# EAGLE design One Dimensional Pong - Rev A.1 (EAGLE 9.2.0)
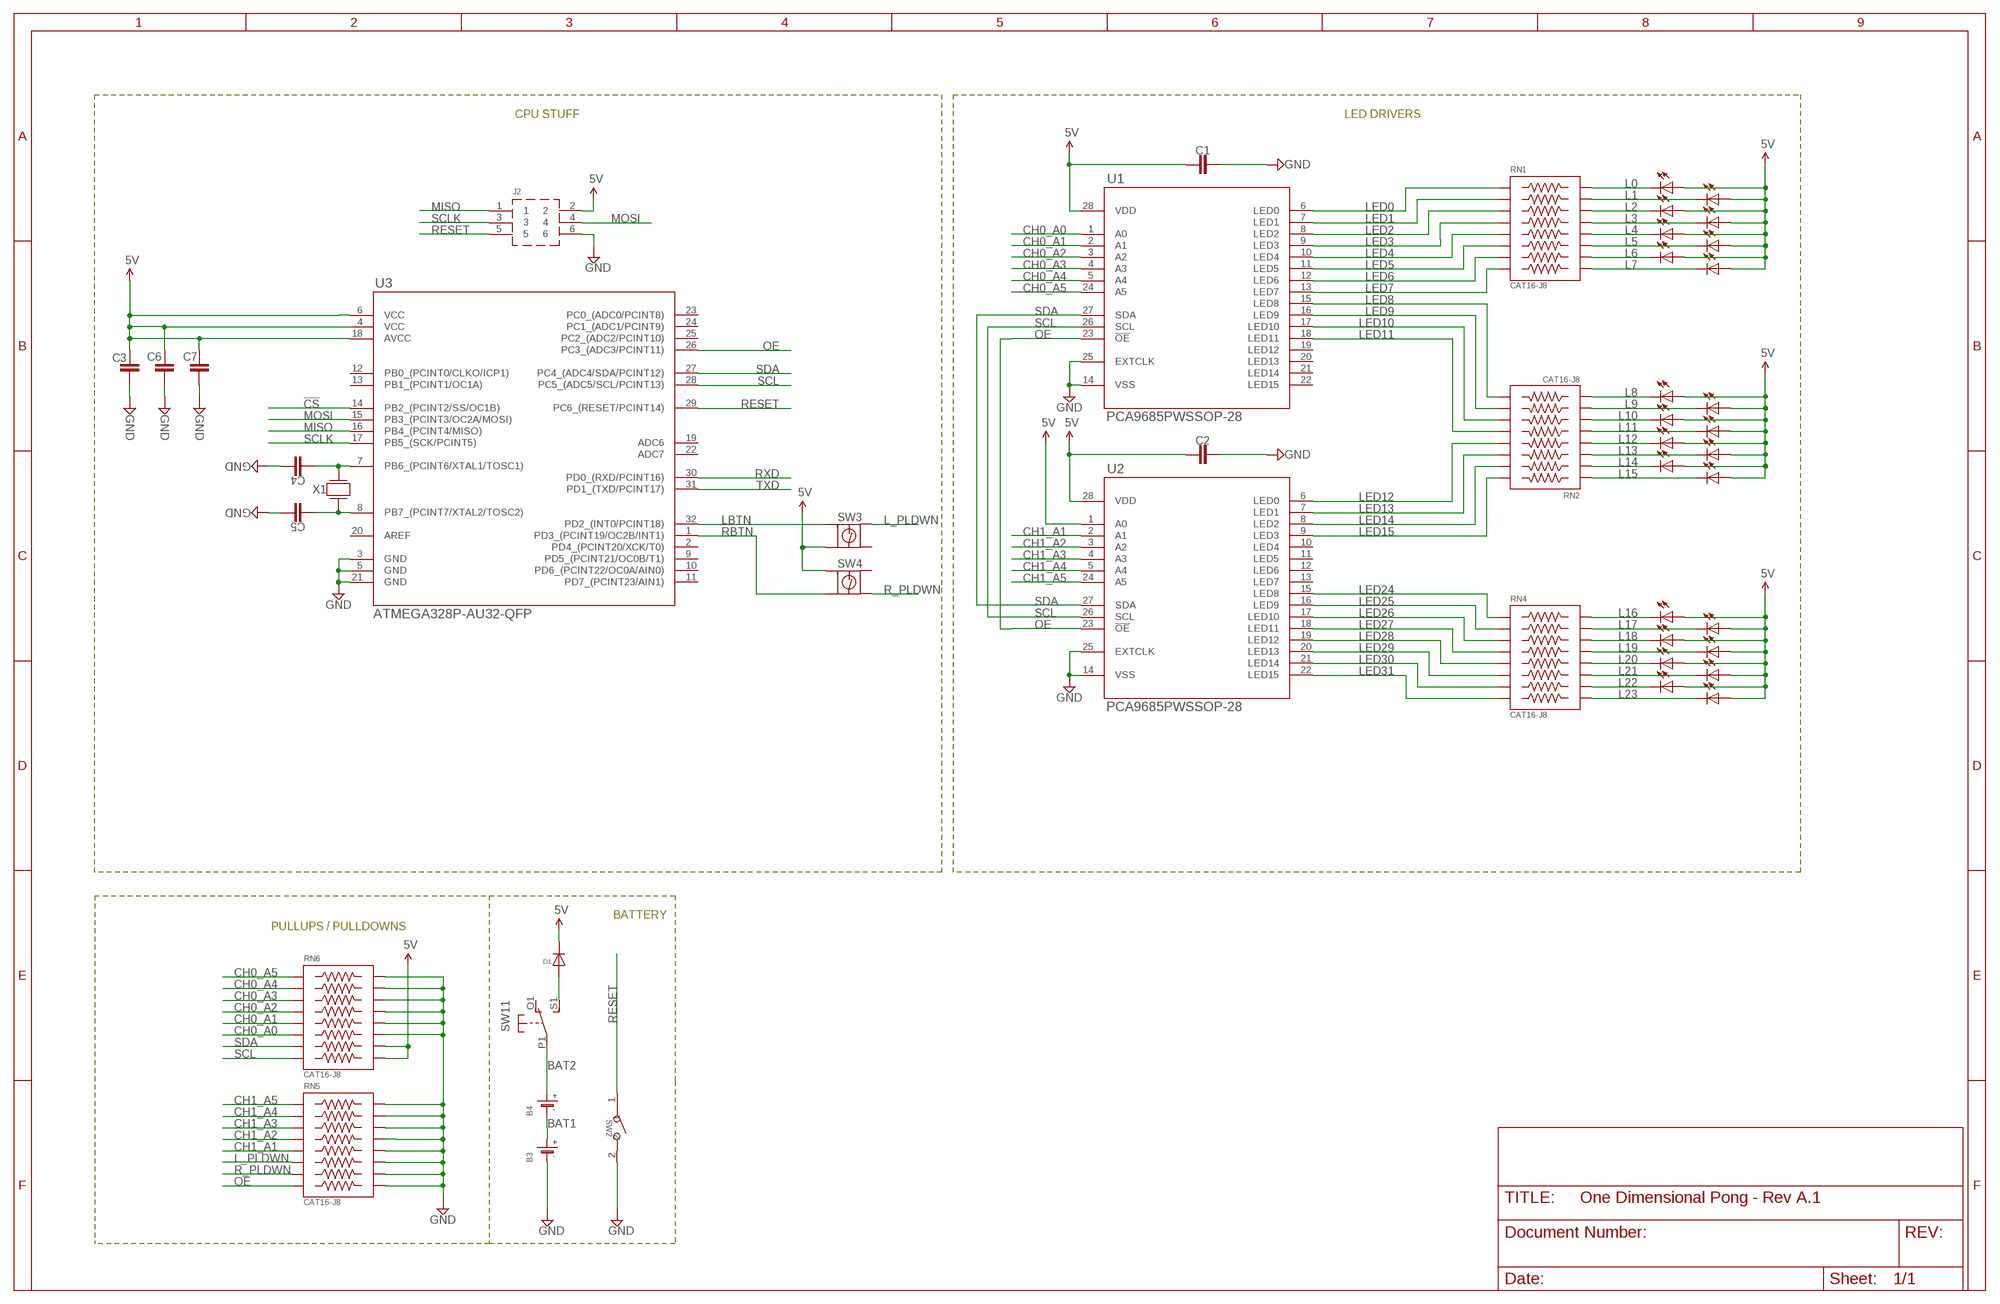
[diagram p0: schematic, sheet 1]

## Parts
B3  BATTERYCR2540-SMT  [CR2450]
B4  BATTERYCR2540-SMT  [CR2450]
C1  C-EUC0805  [C0805]
C2  C-EUC0805  [C0805]
C3  C-EUC0805  [C0805]
C4  C-EUC0805  [C0805]
C5  C-EUC0805  [C0805]
C6  C-EUC0805  [C0805]
C7  C-EUC0805  [C0805]
D1  1N4150W  [SOD-123]
J2  610106249121  [RA-SMT-HDR-2X3]
LED1  LED0805-YELLOW  [CHIP-LED0805-YELLOW]
LED2  LED0805-ORANGE  [CHIP-LED0805-ORANGE]
LED3  LEDCHIPLED_0805  [CHIPLED_0805]
LED4  LED0805-ORANGE  [CHIP-LED0805-ORANGE]
LED5  LED0805-YELLOW  [CHIP-LED0805-YELLOW]
LED6  LED0805-GREEN  [CHIP-LED0805-GREEN]
LED7  LED0805-GREEN  [CHIP-LED0805-GREEN]
LED8  LED0805-GREEN  [CHIP-LED0805-GREEN]
LED9  LED0805-GREEN  [CHIP-LED0805-GREEN]
LED10  LED0805-GREEN  [CHIP-LED0805-GREEN]
LED11  LED0805-GREEN  [CHIP-LED0805-GREEN]
LED12  LED0805-GREEN  [CHIP-LED0805-GREEN]
LED13  LED0805-GREEN  [CHIP-LED0805-GREEN]
LED14  LED0805-GREEN  [CHIP-LED0805-GREEN]
LED15  LED0805-GREEN  [CHIP-LED0805-GREEN]
LED16  LED0805-GREEN  [CHIP-LED0805-GREEN]
LED25  LED0805-GREEN  [CHIP-LED0805-GREEN]
LED26  LED0805-GREEN  [CHIP-LED0805-GREEN]
LED27  LED0805-GREEN  [CHIP-LED0805-GREEN]
LED28  LED0805-YELLOW  [CHIP-LED0805-YELLOW]
LED29  LED0805-ORANGE  [CHIP-LED0805-ORANGE]
LED30  LEDCHIPLED_0805  [CHIPLED_0805]
LED31  LED0805-ORANGE  [CHIP-LED0805-ORANGE]
LED32  LED0805-YELLOW  [CHIP-LED0805-YELLOW]
RN1  CAT16-J8  [RN8]
RN2  CAT16-J8  [RN8]
RN4  CAT16-J8  [RN8]
RN5  CAT16-J8  [RN8]
RN6  CAT16-J8  [RN8]
SW1  DPDT-EG1390  [EG1390]
SW2  B3U-1000P-2P-SMD  SMD-BUTTON(2P-3.0X2.5X1.2+0.4MM)-B3U-1000P-2P-SMD  [SW2-2.6-3.0X2.5X1.2+0.4MM]
SW3  PTS645SM43SMTR92LFS  [PTS645-SMT-6MM]
SW4  PTS645SM43SMTR92LFS  [PTS645-SMT-6MM]
U1  PCA9685PWSSOP-28  [SOP65P640X110-28]
U2  PCA9685PWSSOP-28  [SOP65P640X110-28]
U3  ATMEGA328P-AU32-QFP  [QFP80P897X897X120-32]
X1  ABLS-16.000MHZ-B4-T  [OSC12P7X4P7]

## Nets
5V: C1.1 C2.1 C3.1 C6.1 C7.1 D1.K(C) J2.2 LED1.A LED2.A LED3.A LED4.A LED5.A LED6.A LED7.A LED8.A LED9.A LED10.A LED11.A LED12.A LED13.A LED14.A LED15.A LED16.A LED25.A LED26.A LED27.A LED28.A LED29.A LED30.A LED31.A LED32.A RN6.14 RN6.16 SW3.P$3 SW4.P$1 U1.28(VDD) U2.1(A0) U2.28(VDD) U3.4(VCC) U3.6(VCC) U3.18(AVCC)
!CS: U3.14(PB2_(PCINT2/SS/OC1B))
BAT1: B3.1(+) B3.2(+) B4.GND(-)
BAT2: B4.1(+) B4.2(+) SW1.P1(1:P)
CH0_A0: RN6.11 U1.1(A0)
CH0_A1: RN6.9 U1.2(A1)
CH0_A2: RN6.7 U1.3(A2)
CH0_A3: RN6.5 U1.4(A3)
CH0_A4: RN6.3 U1.5(A4)
CH0_A5: RN6.1 U1.24(A5)
CH1_A1: RN5.9 U2.2(A1)
CH1_A2: RN5.7 U2.3(A2)
CH1_A3: RN5.5 U2.4(A3)
CH1_A4: RN5.3 U2.5(A4)
CH1_A5: RN5.1 U2.24(A5)
GND: B3.GND(-) C1.2 C2.2 C3.2 C4.2 C5.2 C6.2 C7.2 J2.6 RN5.2 RN5.4 RN5.6 RN5.8 RN5.10 RN5.12 RN5.14 RN5.16 RN6.2 RN6.4 RN6.6 RN6.8 RN6.10 RN6.12 SW2.2 U1.14(VSS) U1.25(EXTCLK) U2.14(VSS) U2.25(EXTCLK) U3.3(GND) U3.5(GND) U3.21(GND)
L0: LED1.C RN1.2
L1: LED2.C RN1.4
L2: LED3.C RN1.6
L3: LED4.C RN1.8
L4: LED5.C RN1.10
L5: LED6.C RN1.12
L6: LED7.C RN1.14
L7: LED8.C RN1.16
L8: LED9.C RN2.15
L9: LED10.C RN2.13
L10: LED11.C RN2.11
L11: LED12.C RN2.9
L12: LED13.C RN2.7
L13: LED14.C RN2.5
L14: LED15.C RN2.3
L15: LED16.C RN2.1
L16: LED25.C RN4.2
L17: LED26.C RN4.4
L18: LED27.C RN4.6
L19: LED28.C RN4.8
L20: LED29.C RN4.10
L21: LED30.C RN4.12
L22: LED31.C RN4.14
L23: LED32.C RN4.16
L_PLDWN: RN5.11 SW3.P$2
LBTN: SW3.P$1 U3.32(PD2_(INT0/PCINT18))
LED0: RN1.1 U1.6(LED0)
LED1: RN1.3 U1.7(LED1)
LED2: RN1.5 U1.8(LED2)
LED3: RN1.7 U1.9(LED3)
LED4: RN1.9 U1.10(LED4)
LED5: RN1.11 U1.11(LED5)
LED6: RN1.13 U1.12(LED6)
LED7: RN1.15 U1.13(LED7)
LED8: RN2.16 U1.15(LED8)
LED9: RN2.14 U1.16(LED9)
LED10: RN2.12 U1.17(LED10)
LED11: RN2.10 U1.18(LED11)
LED12: RN2.8 U2.6(LED0)
LED13: RN2.6 U2.7(LED1)
LED14: RN2.4 U2.8(LED2)
LED15: RN2.2 U2.9(LED3)
LED24: RN4.1 U2.15(LED8)
LED25: RN4.3 U2.16(LED9)
LED26: RN4.5 U2.17(LED10)
LED27: RN4.7 U2.18(LED11)
LED28: RN4.9 U2.19(LED12)
LED29: RN4.11 U2.20(LED13)
LED30: RN4.13 U2.21(LED14)
LED31: RN4.15 U2.22(LED15)
MISO: J2.1 U3.16(PB4_(PCINT4/MISO))
MOSI: J2.4 U3.15(PB3_(PCINT3/OC2A/MOSI))
N$2: C4.1 U3.7(PB6_(PCINT6/XTAL1/TOSC1)) X1.2
N$3: C5.1 U3.8(PB7_(PCINT7/XTAL2/TOSC2)) X1.1
N$4: D1.A SW1.S1(1:S)
OE: RN5.15 U1.23(!OE) U2.23(!OE) U3.26(PC3_(ADC3/PCINT11))
R_PLDWN: RN5.13 SW4.P$4
RBTN: SW4.P$3 U3.1(PD3_(PCINT19/OC2B/INT1))
RESET: J2.5 SW2.1 U3.29(PC6_(RESET/PCINT14))
RXD: U3.30(PD0_(RXD/PCINT16))
SCL: RN6.15 U1.26(SCL) U2.26(SCL) U3.28(PC5_(ADC5/SCL/PCINT13))
SCLK: J2.3 U3.17(PB5_(SCK/PCINT5))
SDA: RN6.13 U1.27(SDA) U2.27(SDA) U3.27(PC4_(ADC4/SDA/PCINT12))
TXD: U3.31(PD1_(TXD/PCINT17))
Unconnected: SW1.O1(1:O) SW1.O2(2:O) SW1.P2(2:P) SW1.S2(2:S) SW3.P$4 SW4.P$2 U1.19(LED12) U1.20(LED13) U1.21(LED14) U1.22(LED15) U2.10(LED4) U2.11(LED5) U2.12(LED6) U2.13(LED7) U3.2(PD4_(PCINT20/XCK/T0)) U3.9(PD5_(PCINT21/OC0B/T1)) U3.10(PD6_(PCINT22/OC0A/AIN0)) U3.11(PD7_(PCINT23/AIN1)) U3.12(PB0_(PCINT0/CLKO/ICP1)) U3.13(PB1_(PCINT1/OC1A)) U3.19(ADC6) U3.20(AREF) U3.22(ADC7) U3.23(PC0_(ADC0/PCINT8)) U3.24(PC1_(ADC1/PCINT9)) U3.25(PC2_(ADC2/PCINT10))

## Notes on the sheet
- CPU STUFF | LED DRIVERS
- BATTERY
- PULLUPS / PULLDOWNS

## Library data of the parts
B3 B4 = One Dimensional Pong:BATTERY: CR1220 SMT - Digikey: 3001K-ND CD2032 BAT-HLD-001 - Digikey: BAT-HLD-001-ND
C1-C7 = rcl:C-EU: CAPACITOR, European symbol; SPICEPREFIX: C
D1 = One Dimensional Pong:1N4150W
J2 = RA-SMT-HDR-2x3:610106249121
LED1 LED5 LED28 LED32 = One Dimensional Pong:LED0805-YELLOW
LED2 LED4 LED29 LED31 = One Dimensional Pong:LED0805-ORANGE
LED3 LED30 = led:LED: LED OSRAM: - CHIPLED LG R971, LG N971, LY N971, LG Q971, LY Q971, LO R971, LY R971 LH N974, LH R974 LS Q976, LO Q976, LY Q976 LO Q996 - Hyper CHIPLED LW Q18S LB Q993, LB Q99A, LB R99A - SideLED LS A670, LO A670, LY A670, LG A670, LP A670 LB A673, LV A673, LT A673, LW A673 LH A674 LY A675 LS A676, LA A676, LO A676, LY A676, LW A676 LS A679, LY A679, LG A679 - Hyper Micro SIDELED® LS Y876, LA Y876, LO Y876, LY Y876 LT Y87S - SmartLED LW L88C, LW L88S LB L89C, LB L89S, LG L890 LS L89K, LO L89K, LY L89K LS L896, LA L896, LO L896, LY L896 - TOPLED LS T670, LO T670, LY T670, LG T670, LP T670 LSG T670, LSP T670, LSY T670, LOP T670, LYG T670 LG T671, LOG T671, LSG T671 LB T673, LV T673, LT T673, LW T673 LH T674 LS T676, LA T676, LO T676, LY T676, LB T676, LH T676, LSB T676, LW T676 LB T67C, LV T67C, LT T67C, LS T67K, LO T67K, LY T67K, LW E67C LS E67B, LA E67B, LO E67B, LY E67B, LB E67C, LV E67C, LT E67C LW T67C LS T679, LY T679, LG T679 LS T770, LO T770, LY T770, LG T770, LP T770 LB T773, LV T773, LT T773, LW T773 LH T774 LS E675, LA E675, LY E675, LS T675 LS T776, LA T776, LO T776, LY T776, LB T776 LHGB T686 LT T68C, LB T68C - Hyper Mini TOPLED® LB M676 - Mini TOPLED Santana® LG M470 LS M47K, LO M47K, LY M47K Source: http://www.osram.convergy.de LUXEON: - LUMILED® LXK2-PW12-R00, LXK2-PW12-S00, LXK2-PW14-U00, LXK2-PW14-V00 LXK2-PM12-R00, LXK2-PM12-S00, LXK2-PM14-U00 LXK2-PE12-Q00, LXK2-PE12-R00, LXK2-PE12-S00, LXK2-PE14-T00, LXK2-PE14-U00 LXK2-PB12-K00, LXK2-PB12-L00, LXK2-PB12-M00, LXK2-PB14-N00, LXK2-PB14-P00, LXK2-PB14-Q00 LXK2-PR12-L00, LXK2-PR12-M00, LXK2-PR14-Q00, LXK2-PR14-R00 LXK2-PD12-Q00, LXK2-PD12-R00, LXK2-PD12-S00 LXK2-PH12-R00, LXK2-PH12-S00 LXK2-PL12-P00, LXK2-PL12-Q00, LXK2-PL12-R00 Source: www.luxeon.com KINGBRIGHT: KA-3528ASYC Source: www.kingbright.com
LED6-LED16 LED25-LED27 = One Dimensional Pong:LED0805-GREEN
RN1 RN2 RN4-RN6 = One Dimensional Pong:CAT16-J8
SW1 = One Dimensional Pong:DPDT
SW2 = One Dimensional Pong:SMD-BUTTON(2P-3.0X2.5X1.2+0.4MM): 311020047; MPN: B3U-1000P-2P-SMD; SPICEPREFIX: B
SW3 SW4 = One Dimensional Pong:PTS645SM43SMTR92LFS: SWITCH TACTILE SPST-NO 0.05A 12V
U1 U2 = One Dimensional Pong:PCA9685PW
U3 = One Dimensional Pong:ATMEGA328P-AU
X1 = One Dimensional Pong:ABLS-16.000MHZ-B4-T

## Board
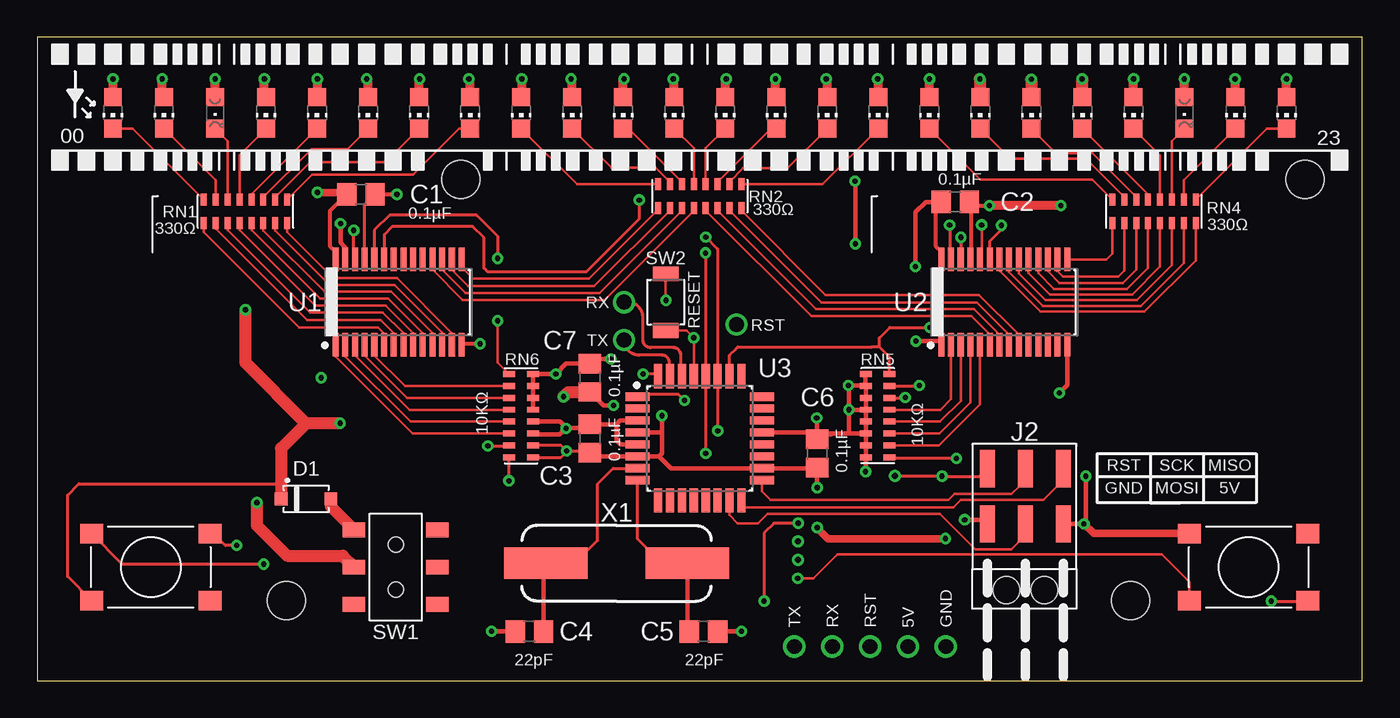
[diagram p1: board, top side]
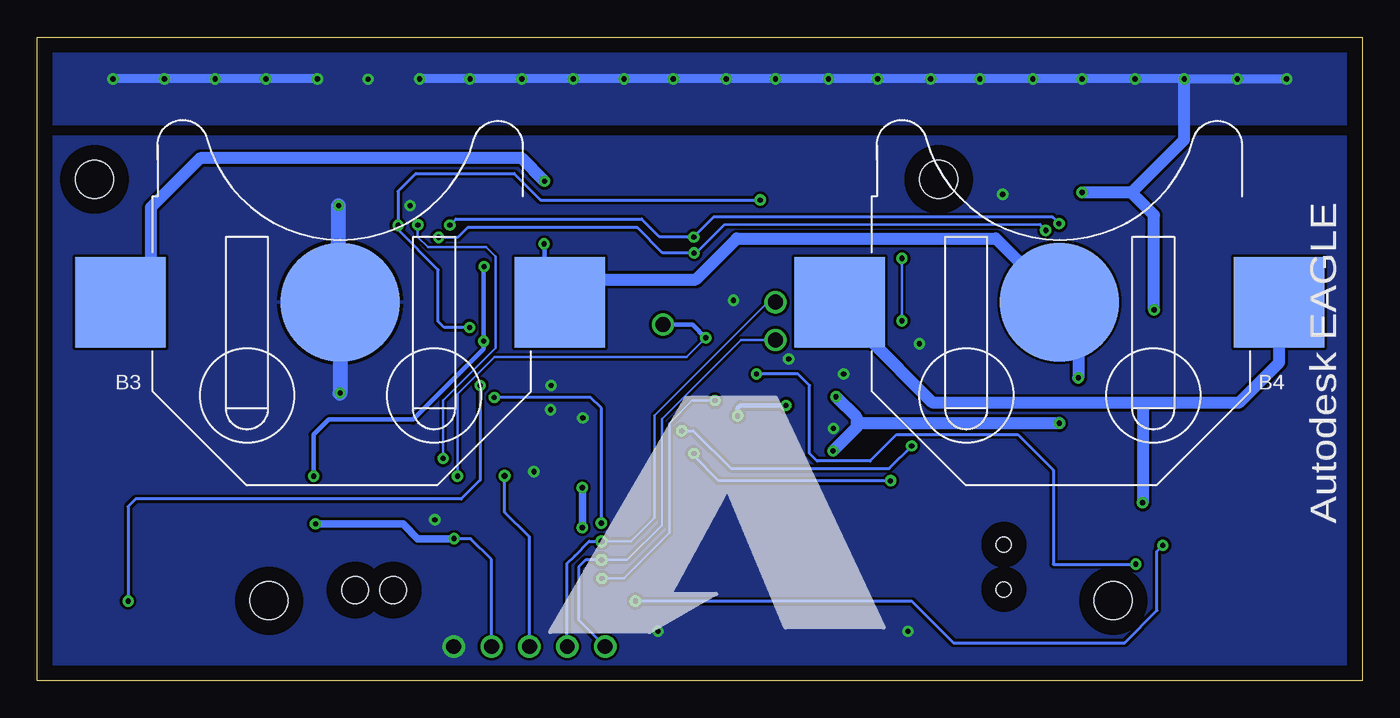
[diagram p2: board, bottom side, seen from below]

Size 88.9 x 43.18 mm. Coordinates in mm from the lower left corner, seen from the top.
Outline: 0,0 88.9,0 88.9,43.18 0,43.18 0,0
Copper layers (1*16): Top 0.035mm / dielectric 1.5mm / Bottom 0.035mm
Design rules "default *": minimum track width 6mil, minimum drill 0.35mm, track to track 7mil, track to pad 7mil, pad to pad 7mil, via to via 7mil, smd to smd 7mil, copper to edge 40mil, drill to drill 6mil, minimum pad ring 10mil, minimum via ring 8mil, stop-mask expansion 4mil, vias tented up to drill 0mil, thermal gap 10mil
Holes 2.54 mm at 16.71,5.36 28.42,33.65 73.35,5.36 85.06,33.65

### Footprints (pad centres in the part's own frame; a part is rotated, then mirrored left to right if it is on the bottom)
CR2450 = smd 6.07 x 6.07: 1 -14.75,0; 2 14.75,0 | smd 8 x 8: GND 0,0
C0805 = smd 1.3 x 1.5: 1 -0.95,0; 2 0.95,0
SOD-123 = smd 0.85 x 0.85: A -1.675,0; K 1.675,0
RA-SMT-HDR-2X3 = smd 1 x 2.5: 1 0,0; 2 0,3.7; 3 2.54,0; 4 2.54,3.7; 5 5.08,0; 6 5.08,3.7 | hole 1.78: 1.27,8.15; 3.81,8.15
CHIP-LED0805-YELLOW = smd 1.2 x 1.2: A 0,-1.05; C 0,1.05
CHIP-LED0805-ORANGE = smd 1.2 x 1.2: A 0,-1.05; C 0,1.05
CHIPLED_0805 = smd 1.2 x 1.2: A 0,-1.05; C 0,1.05
CHIP-LED0805-GREEN = smd 1.2 x 1.2: A 0,-1.05; C 0,1.05
RN8 = smd 0.8 x 0.4: 1 -0.8,2.8; 2 0.8,2.8; 3 -0.8,2; 4 0.8,2; 5 -0.8,1.2; 6 0.8,1.2; 7 -0.8,0.4; 8 0.8,0.4; 9 -0.8,-0.4; 10 0.8,-0.4; 11 -0.8,-1.2; 12 0.8,-1.2; 13 -0.8,-2; 14 0.8,-2; 15 -0.8,-2.8; 16 0.8,-2.8
EG1390 = smd 1 x 1.5: O1 -2.5,2.8; O2 -2.5,-2.8; P1 0,2.8; P2 0,-2.8; S1 2.5,2.8; S2 2.5,-2.8 | hole 1: 1.5,0; -1.5,0
SW2-2.6-3.0X2.5X1.2+0.4MM = smd 1 x 1.7: 1 -1.9,0; 2 1.9,0
PTS645-SMT-6MM = smd 1.55 x 1.3: P$1 -3.975,2.25; P$2 3.975,2.25; P$3 -3.975,-2.25; P$4 3.975,-2.25
SOP65P640X110-28 = smd 1.572 x 0.407: 1 -2.872,4.225; 2 -2.872,3.575; 3 -2.872,2.925; 4 -2.872,2.275; 5 -2.872,1.625; 6 -2.872,0.975; 7 -2.872,0.325; 8 -2.872,-0.325; 9 -2.872,-0.975; 10 -2.872,-1.625; 11 -2.872,-2.275; 12 -2.872,-2.925; 13 -2.872,-3.575; 14 -2.872,-4.225; 15 2.872,-4.225; 16 2.872,-3.575; 17 2.872,-2.925; 18 2.872,-2.275; 19 2.872,-1.625; 20 2.872,-0.975; 21 2.872,-0.325; 22 2.872,0.325; 23 2.872,0.975; 24 2.872,1.625; 25 2.872,2.275; 26 2.872,2.925; 27 2.872,3.575; 28 2.872,4.225
QFP80P897X897X120-32 = smd 1.621 x 0.547: 1 -4.17,2.8; 2 -4.17,2; 3 -4.17,1.2; 4 -4.17,0.4; 5 -4.17,-0.4; 6 -4.17,-1.2; 7 -4.17,-2; 8 -4.17,-2.8; 17 4.17,-2.8; 18 4.17,-2; 19 4.17,-1.2; 20 4.17,-0.4; 21 4.17,0.4; 22 4.17,1.2; 23 4.17,2; 24 4.17,2.8 | smd 0.547 x 1.621: 9 -2.8,-4.17; 10 -2,-4.17; 11 -1.2,-4.17; 12 -0.4,-4.17; 13 0.4,-4.17; 14 1.2,-4.17; 15 2,-4.17; 16 2.8,-4.17; 25 2.8,4.17; 26 2,4.17; 27 1.2,4.17; 28 0.4,4.17; 29 -0.4,4.17; 30 -1.2,4.17; 31 -2,4.17; 32 -2.8,4.17
OSC12P7X4P7 = smd 5.588 x 2.108: 1 -4.75,0; 2 4.75,0

### Placement (x,y rotation side)
B3  68.58,25.4 0 bottom
B4  20.32,25.4 0 bottom
C1  21.72,32.64 0 top
C2  61.59,32.13 0 top
C3  37.08,16.26 90 top
C4  33.02,3.3 180 top
C5  44.7,3.3 0 top
C6  52.32,15.24 90 top
C7  37.08,20.32 90 top
D1  18.03,12.19 180 top
J2  68.83,14.22 180 top
LED1  5.08,38.1 180 top
LED2  8.5,38.1 180 top
LED3  11.93,38.1 180 top
LED4  15.35,38.1 180 top
LED5  18.77,38.1 180 top
LED6  22.2,38.1 180 top
LED7  25.62,38.1 180 top
LED8  29.04,38.1 180 top
LED9  32.47,38.1 180 top
LED10  35.89,38.1 180 top
LED11  39.31,38.1 180 top
LED12  42.74,38.1 180 top
LED13  46.16,38.1 180 top
LED14  49.59,38.1 180 top
LED15  53.01,38.1 180 top
LED16  56.43,38.1 180 top
LED25  59.86,38.1 180 top
LED26  63.28,38.1 180 top
LED27  66.7,38.1 180 top
LED28  70.13,38.1 180 top
LED29  73.55,38.1 180 top
LED30  76.97,38.1 180 top
LED31  80.4,38.1 180 top
LED32  83.82,38.1 180 top
RN1  13.97,31.5 90 top
RN2  44.45,32.51 270 top
RN4  74.93,31.5 90 top
RN5  56.39,17.78 180 top
RN6  32.46,17.78 0 top
SW1  24.05,7.62 90 top
SW2  42.16,25.4 90 top
SW3  7.62,7.62 0 top
SW4  81.28,7.62 0 top
U1  24.24,25.4 90 top
U2  64.88,25.4 90 top
U3  44.45,16.26 0 top
X1  38.86,7.87 180 top

### Tracks (layer width: path | path; a pad name or v marks a point on that pad's centre or on a via)
5V  (via drill 0.35, 1)
  Top 0.203: RN6.16 35.15,14.98 35.51,15.34 v35.51,15.42 | v35.51,15.42 35.15,15.78 RN6.14 | v35.51,15.42 37.06,15.42 37.08,15.39 | SW3.P$3 2.03,6.98 2.03,12.45 2.79,13.21 16.36,13.21
  Top 0.254: 37.33,15.06 C3.1 | C2.1 60.26,31.75 60.26,29.17 60.66,28.78 U2.28 | C1.1 19.62,31.5 19.62,29.17 20.02,28.78 U1.28
  Top 0.305: 37.08,15.39 C3.1 | J2.2 68.84,10.52 70.1,10.52 | 70.1,10.52 v70.23,10.52 | 41.73,15.06 42.53,14.26 U3.18 52.29,14.26 C6.1 v52.32,12.95 | v70.36,13.72 70.36,10.77 70.1,10.52 | v58.93,27.79 58.93,31.43 59.63,32.13 C2.1 | U2.1 60.66,22.78 v58.95,22.78 | 41.91,16.66 v41.91,17.78 | 41.91,16.66 U3.4 | 37.33,15.06 U3.6 41.73,15.06 | v38.66,18.47 37.99,18.47 C7.1 | 41.73,15.06 41.91,15.24 41.91,16.66
  Top 0.508: SW4.P$1 70.88,9.87 v70.23,10.52 | v18.8,32.77 20.64,32.77 | v60.94,9.53 58.93,9.53 53.06,9.53 v52.32,10.26
  Top 0.61: LED1.A v5.08,40.39 | LED2.A 8.38,39.27 v8.38,40.39 | 11.94,39.16 v11.94,40.39 | LED4.A 15.24,39.26 v15.24,40.39 | LED5.A 18.8,39.17 v18.8,40.39 | LED6.A 22.2,40.29 v22.1,40.39 | LED7.A 25.62,40.35 v25.65,40.39 | LED8.A 29.04,40.37 29.03,40.39 v28.96,40.39 | LED9.A 32.51,39.19 v32.51,40.39 | LED10.A 35.89,40.38 35.89,40.39 v35.81,40.39 | LED11.A 39.31,40.33 v39.37,40.39 | LED12.A 42.74,40.32 v42.67,40.39 | LED13.A 46.16,40.32 v46.23,40.39 | LED14.A 49.53,39.2 v49.53,40.39 | LED15.A 53.01,40.36 52.98,40.39 v52.93,40.39 | LED16.A 56.43,40.34 v56.39,40.39 | LED25.A 59.86,40.4 59.87,40.41 v59.87,40.39 | LED29.A 73.55,40.38 v73.56,40.39 | LED30.A 76.96,39.16 v76.96,40.39 | LED31.A 80.4,40.35 v80.37,40.39 | LED32.A v83.82,40.39 | v83.82,40.39
  Top 0.813: v35.31,19.05 35.63,19.37 C7.1 | 20.64,32.77 C1.1 | 18.03,17.27 16.36,15.6 16.36,13.21 D1.K | v20.32,17.27 18.03,17.27 | 18.03,17.27 13.97,21.34 v13.97,24.89 | LED3.A 11.94,39.16 | v66.7,40.36 LED27.A | LED28.A 70.13,40.36 v70.1,40.39 | v63.25,40.39 63.25,39.18 LED26.A
  Bottom 0.2: v60.94,9.53 59.82,9.53 58.42,8.13 v58.42,2.29
  Bottom 0.305: v41.91,17.78 41.91,18.29 41.73,18.47 v38.66,18.47 | v70.36,13.72 70.36,16.51 69.34,17.53 63.68,17.53 58.95,22.25 v58.95,22.78 58.95,27.76 v58.93,27.79
  Bottom 0.508: v70.23,10.52 64.36,10.52 63.37,9.53 v60.94,9.53 | v52.32,10.26 v52.32,12.95
  Bottom 0.61: v63.25,40.39 v59.87,40.39 v56.39,40.39 v52.93,40.39 v49.53,40.39 v46.23,40.39 v42.67,40.39 v39.37,40.39 v35.81,40.39 v32.51,40.39 v28.96,40.39 v25.65,40.39 v22.1,40.39 v18.8,40.39 v15.24,40.39 v11.94,40.39 v8.38,40.39 v5.08,40.39 | v70.1,40.39 v73.56,40.39 v76.96,40.39 v80.37,40.39 v83.82,40.39
  Bottom 0.813: 33.91,17.3 20.34,17.3 v20.32,17.27 | v35.51,15.42 33.91,17.02 33.91,17.3 | 33.91,17.3 33.91,17.65 v35.31,19.05 | v13.97,24.89 13.97,31.24 15.49,32.77 | 15.49,32.77 v18.8,32.77 | 15.49,32.77 11.94,36.32 v11.94,40.39
  pour Bottom: 0,37.59 0,43.18 88.9,43.18 88.9,37.34 0,37.34
BAT1  (via drill 0.35)
  Top 0.305: v54.89,29.31 54.89,33.5 v54.86,33.53
  Bottom 0.305: B3.2 54.86,26.43 54.86,29.29 v54.89,29.31
  Bottom 0.813: v54.86,33.53 56.39,35.05 77.98,35.05 81.28,31.75 81.28,27.45 B3.1 | B3.2 52.31,26.92 44.7,26.92 41.96,29.67 24.59,29.67 B4.GND 19.05,24.13 v19.05,20.32
BAT2  (via drill 0.35)
  Top 0.813: v14.73,11.94 14.73,10.41 16.77,8.37 20.5,8.37 SW1.P1
  Bottom 0.813: B4.2 5.57,21.35 8.29,18.64 | v14.73,11.94 14.73,18.64 8.29,18.64 | 8.29,18.64 28.8,18.64 33.27,23.11 33.27,23.62 35.05,25.4 B4.1
CH0_A0
  Top 0.152: RN6.11 25.18,16.58 20.02,21.74 U1.1
CH0_A1
  Top 0.152: RN6.9 25.04,17.38 20.67,21.75 U1.2
CH0_A2
  Top 0.152: RN6.7 24.97,18.18 21.32,21.83 U1.3
CH0_A3
  Top 0.152: RN6.5 24.82,18.98 21.97,21.83 U1.4
CH0_A4
  Top 0.152: RN6.3 24.67,19.78 22.62,21.83 U1.5
CH0_A5  (via drill 0.35)
  Top 0.152: RN6.1 30.9,21.34 30.9,24.14 v30.89,24.16
  Top 0.203: v30.89,28.35 30.89,29.82 29.46,31.24 23.63,31.24 22.62,30.23 U1.24
  Bottom 0.152: v30.89,28.35 v30.89,24.16
CH1_A1
  Top 0.152: RN5.9 60.6,18.18 61.31,18.89 U2.2
CH1_A2
  Top 0.152: RN5.7 60.56,17.38 61.96,18.78 U2.3
CH1_A3
  Top 0.152: RN5.5 60.52,16.58 62.61,18.66 U2.4
CH1_A4
  Top 0.152: RN5.3 60.48,15.78 63.25,18.54 63.25,22.52 U2.5
CH1_A5  (via drill 0.35)
  Top 0.152: v63.37,30.58 63.37,28.39 U2.24 | 57.26,14.91 RN5.1
  Top 0.203: v61.67,14.91 57.26,14.91 RN5.1
  Bottom 0.152: v63.37,30.58 63.37,29.77 62.69,29.08 58.8,29.08 58.17,28.45 58.17,22.31 61.67,18.81 v61.67,14.91
GND  (via drill 0.35, 1)
  Top 0.152: v42.19,25.53 42.16,25.55 SW2.2
  Top 0.203: U1.25 21.97,31.94 C1.2
  Top 0.254: C2.2 62.41,32.13 62.66,31.88 | 62.66,31.88 v63.88,31.88 | v29.72,22.61 28.54,22.61 U1.14 | U2.25 62.69,28.35 62.69,31.85 62.66,31.88 | C1.2 v24.13,32.64
  Top 0.305: U3.5 39.13,15.86 38.86,16.13 38.86,17.2 | U3.3 39.12,17.46 38.86,17.2 | 38.86,17.2 38.86,17.21 C3.2 36.83,16.95 35.52,16.95 | 35.52,16.95 35.48,16.99 v35.48,16.92 35.48,16.94 35.05,16.51 33.33,16.51 RN6.12 | RN5.6 54.36,16.58 | 54.36,16.58 53.34,16.58 | 53.34,16.58 52.71,16.58 C6.2 | RN5.6 RN5.4 RN5.2 55.61,14.96 55.61,14.06 v55.58,14.02 | v54.46,18.19 v54.46,18.18 RN5.10 | v68.58,19.3 69.11,19.83 U2.14 | RN6.10 35.09,17.38 35.52,16.95 | v38.48,21.59 37.4,21.59 C7.2 35.49,21.27 v34.8,20.57 RN6.2 RN6.4 RN6.6 RN6.8 | RN5.10 RN5.12 RN5.14 55.56,19.81 | 55.56,19.81 v54.43,19.81 54.46,19.79 v54.46,18.19 | C5.2 v47.24,3.3 | C4.2 v30.48,3.3 | RN5.6 RN5.8 RN5.10 | 55.56,19.81 55.56,20.55 RN5.16 | U3.21 51.05,16.66 51.86,16.66 C6.2 | C6.2 52.32,16.51 | 52.32,16.51 52.32,16.76 | 52.32,16.76 52.32,17.6 v52.3,17.63 | 53.34,16.58 53.27,16.51 52.32,16.51 | C6.2 52.32,16.76 | v54.46,18.19 54.46,16.68 54.36,16.58 | J2.6 63.75,10.78 62.23,10.78 v62.23,10.79
  Top 0.61: v68.68,31.88 v63.88,31.88
  Bottom 1.016: v68.58,19.3 B3.GND 68.68,25.5 68.68,30.48 v68.68,31.88
  other vias: 60.96,2.29
  pour Bottom: 88.9,0 0,0 0,36.58 88.9,36.58
L0
  Top 0.152: LED1.C 6.42,37.05 RN1.2
L1
  Top 0.152: LED2.C 11.97,33.58 RN1.4
L2
  Top 0.152: LED3.C 12.77,36.21 RN1.6
L3
  Top 0.152: LED4.C 13.57,35.27 RN1.8
L4
  Top 0.152: LED5.C 14.37,32.65 RN1.10
L5
  Top 0.152: LED6.C 20.83,35.69 18.4,35.69 15.17,32.45 RN1.12
L6
  Top 0.152: LED7.C 23.36,34.79 18.31,34.79 15.97,32.45 RN1.14
L7
  Top 0.152: RN1.16 18.44,33.97 25.22,33.97 28.31,37.05 LED8.C
L8
  Top 0.152: RN2.15 36.21,33.31 LED9.C
L9
  Top 0.152: RN2.13 42.45,33.47 41.5,34.42 38.52,34.42 LED10.C
L10
  Top 0.152: RN2.11 43.25,33.47 39.67,37.05 LED11.C
L11
  Top 0.152: LED12.C 44.05,35.74 RN2.9
L12
  Top 0.152: LED13.C 44.85,35.74 RN2.7
L13
  Top 0.152: LED14.C 49.23,37.05 45.65,33.47 RN2.5
L14
  Top 0.152: LED15.C 50.35,34.39 47.37,34.39 46.45,33.47 RN2.3
L15
  Top 0.152: LED16.C 52.69,33.31 RN2.1
L16
  Top 0.152: RN4.2 70.8,33.63 63.28,33.63 LED25.C
L17
  Top 0.152: RN4.4 72.93,32.45 70.35,35.04 65.29,35.04 LED26.C
L18
  Top 0.152: RN4.6 73.73,32.45 70.79,35.4 68.35,35.4 LED27.C
L19
  Top 0.152: LED28.C 74.53,32.65 RN4.8
L20
  Top 0.152: LED29.C 75.33,35.27 RN4.10
L21
  Top 0.152: LED30.C 76.13,36.21 RN4.12
L22
  Top 0.152: LED31.C 76.93,33.58 RN4.14
L23
  Top 0.152: LED32.C 82.48,37.05 RN4.16
L_PLDWN  (via drill 0.35)
  Top 0.2: v48.77,5.33 48.77,9.91 49.43,10.57 v51.05,10.57
  Top 0.203: RN5.11 58.31,18.98 58.32,18.97 58.27,18.97 v58.24,19 | SW3.P$2 11.82,9.87 12.62,9.07 v13.38,9.07
  Bottom 0.2: v51.05,10.57 51.05,18.29
  Bottom 0.203: v48.77,5.33 30.23,5.33 27.44,2.55 15.93,2.55 13.78,4.7 13.78,8.67 v13.38,9.07 | 51.05,18.29 51.77,19 v58.24,19
LBTN  (via drill 0.35)
  Top 0.203: U3.32 41.5,20.57 v40.64,20.57 | SW3.P$1 5.7,7.81 14.79,7.81 v15.19,7.81
  Bottom 0.203: v15.19,7.81 20.73,7.81 20.73,14.13 23.11,16.51 31.24,16.51 33.02,14.73 36.58,14.73 37.08,15.24 37.08,19.81 37.85,20.57 v40.64,20.57
LED0
  Top 0.152: U1.6 23.27,23.29 22.86,23.7 17.56,23.7 11.17,30.09 RN1.1
LED1
  Top 0.152: U1.7 23.92,23.34 23.04,24.22 18.1,24.22 11.97,30.34 RN1.3
LED2
  Top 0.152: U1.8 24.57,23.32 23.18,24.7 18.31,24.7 12.77,30.24 RN1.5
LED3
  Top 0.152: U1.9 25.22,23.32 23.37,25.17 18.64,25.17 13.57,30.24 RN1.7
LED4
  Top 0.152: U1.10 25.87,23.32 23.55,25.63 18.98,25.63 14.37,30.24 RN1.9
LED5
  Top 0.152: U1.11 26.52,23.32 23.74,26.09 19.29,26.09 15.17,30.22 RN1.11
LED6
  Top 0.152: RN1.13 15.97,30.19 19.6,26.56 23.98,26.56 27.17,23.37 U1.12
LED7
  Top 0.152: U1.13 27.82,23.34 24.14,27.02 19.85,27.02 16.77,30.1 RN1.15
LED8
  Top 0.152: U1.15 28.49,28.25 28.49,27.74 29.25,26.98 37.02,26.98 41.65,31.61 RN2.16
LED9
  Top 0.152: RN2.14 42.45,31.55 37.37,26.47 28.92,26.47 27.82,27.57 U1.16
LED10
  Top 0.152: RN2.12 43.25,31.55 37.71,26.01 28.73,26.01 27.17,27.57 U1.17
LED11
  Top 0.152: RN2.10 44.05,31.55 38.05,25.55 28.53,25.55 26.52,27.57 U1.18
LED12
  Top 0.152: U2.6 63.91,23.23 62.68,24.45 51.95,24.45 44.85,31.55 RN2.8
LED13
  Top 0.152: U2.7 64.56,23.23 62.84,24.95 52.26,24.95 45.65,31.55 RN2.6
LED14
  Top 0.152: U2.8 65.21,23.23 63.05,25.39 54.1,25.39 52.62,25.39 46.45,31.55 RN2.4
LED15
  Top 0.152: U2.9 65.86,23.23 63.19,25.89 52.89,25.89 47.25,31.53 RN2.2
LED24
  Top 0.152: U2.15 71.74,28.27 72.13,28.66 RN4.1
LED25
  Top 0.152: U2.16 68.46,27.48 68.81,27.13 72.53,27.13 72.93,27.52 RN4.3
LED26
  Top 0.152: U2.17 67.81,27.48 68.59,26.7 72.83,26.7 73.73,27.6 RN4.5
LED27
  Top 0.152: U2.18 67.16,27.36 68.22,26.29 73.12,26.29 74.53,27.7 RN4.7
LED28
  Top 0.152: U2.19 66.51,27.36 67.95,25.91 73.46,25.91 75.33,27.78 RN4.9
LED29
  Top 0.152: U2.20 65.86,27.32 67.63,25.55 73.77,25.55 76.13,27.91 RN4.11
LED30
  Top 0.152: U2.21 65.21,27.43 67.49,25.15 67.82,25.15 68.58,25.15 74.04,25.15 76.93,28.04 RN4.13
LED31
  Top 0.152: U2.22 64.56,27.52 67.31,24.77 74.3,24.77 77.73,28.2 RN4.15
MISO
  Top 0.152: J2.1 68.58,13.97 68.58,13.21 67.51,12.14 61.97,12.14 61.47,11.63 47.5,11.63 47.22,11.35 47.25,11.38 U3.16
MOSI
  Top 0.152: 66.29,9.76 J2.4 | U3.15 46.45,11.11 46.99,10.57 48.36,10.57 49,11.2 60.56,11.2 62.94,8.82 65.35,8.82 66.24,9.71
  Top 0.2: 66.24,9.71 66.29,9.76
N$2
  Top 0.203: X1.2 34.37,8.13 36.32,8.13 37.59,9.4 37.59,13.21 38.64,14.26 U3.7
  Top 0.305: C4.1 33.97,8.19 33.78,8.38 34.11,8.05 X1.2
N$3
  Top 0.203: X1.1 41.91,7.87 40.28,9.5 U3.8
  Top 0.305: C5.1 43.61,3.44 X1.1
N$4
  Top 0.813: D1.A 19.71,11.66 SW1.S1
OE  (via drill 0.35)
  Top 0.2: U3.26 46.45,21.85 46.9,22.3 47,22.4 56,22.4 56.5,22.4 | RN5.15 57.19,21.71 56.5,22.4 | 56.5,22.4 56.5,23 57.2,23.7 v59.9,23.7
  Top 0.203: U2.23 63.91,29.49 64.69,30.28 v64.69,30.56 | 23.29,28.3 U1.23 23.29,28.3 | v40.39,32.26 40.39,30.99 36.83,27.43 30.23,27.43 29.97,27.69 29.97,29.72 29.21,30.48 23.82,30.48 23.29,29.95 23.29,28.3
  Bottom 0.2: v59.9,23.7 61.6,23.7 62,24.1 62,27.57 64.69,30.26 v64.69,30.56
  Bottom 0.203: v64.69,30.56 64.69,32.84 63.5,34.04 56.9,34.04 55.12,32.26 v40.39,32.26
R_PLDWN  (via drill 0.35)
  Top 0.203: RN5.13 59.15,19.78 v59.18,19.81 | v82.8,5.33 85.22,5.33 SW4.P$4
  Bottom 0.203: v59.18,19.81 59.18,13.46 60.45,12.19 82.3,12.19 82.8,11.68 v82.8,5.33
RBTN  (via drill 0.35)
  Top 0.152: SW4.P$3 77.31,6.64 75.46,8.48 53.7,8.48 52.07,6.86 v51.03,6.86
  Top 0.203: v43.43,18.8 43.03,19.2 40.42,19.2 U3.1
  Bottom 0.152: v43.43,18.8 44.96,18.8 46.48,17.27 46.48,9.91 49.53,6.86 v51.03,6.86
RESET  (via drill 0.35, 0.4, 1)
  Top 0.152: U3.29 v44.05,23.01 43.56,23.5 SW2.1
  Top 0.203: v57.53,13.74 60.68,13.74 v60.71,13.72 63.25,13.72 J2.5
  Bottom 0.152: v60.71,13.72 60.71,19.23 58.22,21.72 45.34,21.72 v44.05,23.01
  Bottom 0.2: v57.53,13.74 57.53,11.3 55.88,9.65 v55.88,2.29
  Bottom 0.305: v44.05,23.01 44.95,23.9 v46.91,23.9
RXD  (via drill 0.4, 1)
  Top 0.203: U3.30 arc-90 43.18,20.5 43.18,21.84 arc90 42.67,22.35 41.15,22.35 arc-90 40.64,22.86 40.64,24.38 arc90 39.62,25.4 v39.37,25.4
  Bottom 0.152: v39.37,25.4 39.88,25.4 47.5,17.78 47.5,10.92 49.07,9.35 50.8,9.35 v51.05,9.35
  Bottom 0.2: v53.34,2.29 53.34,7.87 52.83,8.38 51.87,9.35 50.8,9.35
SCL  (via drill 0.35)
  Top 0.203: v44.83,28.7 44.83,20.45 U3.28 v44.85,15.24 | v61.97,29.74 61.97,28.29 U2.26 | v21.23,30.22 v21.24,30.22 21.24,28.35 U1.26 | v31.65,13.41 31.66,13.42 RN6.15
  Bottom 0.203: v21.23,30.22 21.62,30.61 42.82,30.59 44.7,28.7 v44.83,28.7 46.94,28.7 48.64,30.4 60.04,30.4 60.7,29.74 v61.97,29.74 | v31.65,13.41 43.18,13.41 44.85,15.08 v44.85,15.24
SCLK
  Top 0.152: J2.3 66.29,13.46 65.91,13.08 65.35,12.52 61.53,12.52 61.14,12.13 49.19,12.13 48.62,12.7 U3.17
SDA  (via drill 0.35)
  Top 0.203: U2.27 61.24,28.34 61.24,30.55 v61.21,30.57 | v44.86,29.77 45.65,28.98 U3.27 v45.65,16.76 | v30.23,15.75 31.63,15.75 RN6.13 | 20.67,28.45 U1.27
  Top 0.305: v20.34,30.67 20.34,29.4 20.67,29.08 20.67,28.45
  Bottom 0.203: v20.34,30.67 20.77,31.1 43.53,31.1 v44.86,29.77 47.14,29.77 48.35,30.98 60.81,30.98 v61.21,30.57 | v30.23,15.75 31.75,14.22 42.35,14.22 44.89,16.76 v45.65,16.76
TXD  (via drill 0.4, 1)
  Top 0.203: U3.31 arc-90 42.42,20.46 42.42,21.34 arc90 41.91,21.84 40.39,21.84 arc-90 v39.37,22.86
  Bottom 0.152: v39.37,22.86 41.69,22.86 46.99,17.56 46.99,10.41 49.31,8.09 v51.05,8.09
  Bottom 0.2: v51.05,8.09 52.11,8.09 52.58,7.62 52.58,4.06 v50.8,2.29

### Text on the board
tPlace: 330Ω | 330Ω | 330Ω | RESET | 10KΩ | 10KΩ | 22pF | 22pF
tNames: 00 | 23 | 0.1µF | 0.1µF | RX | RST | TX | 0.1µF | 0.1µF | 0.1µF | RST | SCK | MISO | GND | MOSI | 5V | TX | RX | RST | 5V | GND
bNames: Autodesk EAGLE